# Altium project PowerBoard.PrjPcb
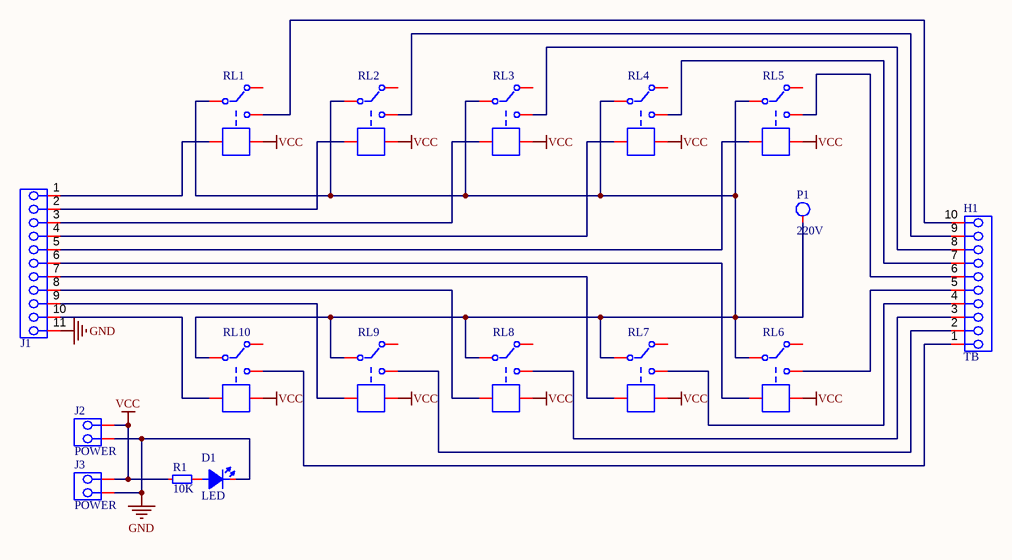
[diagram p0: PowerBoard.SchDoc]
1 sheet, 17 parts. Net scope: global (net labels, ports and power ports of the same name join across sheets).
Board file: PowerBoard.PcbDoc

## Sheet PowerBoard.SchDoc
size A; SheetNumber: 1; SheetTotal: 1

### Parts
D1  LED  [LED_5MM]
H1  TB  [TERMINAL-BLOCK-7.62MM -10PIN]
J1  HEADER-MALE-2.54MM  [HEADER-MALE-11PINS-2.54MM]  (value not drawn)
J2  POWER  [DG306-5.0-02P-12-00AH]
J3  POWER  [DG306-5.0-02P-12-00AH]
P1  220V  [SolderPoint]
R1  10K  [RES-0.25W-H]
RL1  Relay-SONGLE-SRD-05VDC  [RELAY-SONGLE-SRD-05VDC_BLUE]  (value not drawn)
RL2  Relay-SONGLE-SRD-05VDC  [RELAY-SONGLE-SRD-05VDC_BLUE]  (value not drawn)
RL3  Relay-SONGLE-SRD-05VDC  [RELAY-SONGLE-SRD-05VDC_BLUE]  (value not drawn)
RL4  Relay-SONGLE-SRD-05VDC  [RELAY-SONGLE-SRD-05VDC_BLUE]  (value not drawn)
RL5  Relay-SONGLE-SRD-05VDC  [RELAY-SONGLE-SRD-05VDC_BLUE]  (value not drawn)
RL6  Relay-SONGLE-SRD-05VDC  [RELAY-SONGLE-SRD-05VDC_BLUE]  (value not drawn)
RL7  Relay-SONGLE-SRD-05VDC  [RELAY-SONGLE-SRD-05VDC_BLUE]  (value not drawn)
RL8  Relay-SONGLE-SRD-05VDC  [RELAY-SONGLE-SRD-05VDC_BLUE]  (value not drawn)
RL9  Relay-SONGLE-SRD-05VDC  [RELAY-SONGLE-SRD-05VDC_BLUE]  (value not drawn)
RL10  Relay-SONGLE-SRD-05VDC  [RELAY-SONGLE-SRD-05VDC_BLUE]  (value not drawn)

### Nets
GND: D1.2(K) J1.11 J2.2 J3.2
VCC: J2.1 J3.1 R1.1 RL1.3 RL2.3 RL3.3 RL4.3 RL5.3 RL6.3 RL7.3 RL8.3 RL9.3 RL10.3
NetD1_1: D1.1(A) R1.2
NetH1_1: H1.1 RL10.4
NetH1_2: H1.2 RL9.4
NetH1_3: H1.3 RL8.4
NetH1_4: H1.4 RL7.4
NetH1_5: H1.5 RL6.4
NetH1_6: H1.6 RL5.4
NetH1_7: H1.7 RL4.4
NetH1_8: H1.8 RL3.4
NetH1_9: H1.9 RL2.4
NetH1_10: H1.10 RL1.4
NetJ1_1: J1.1 RL1.1
NetJ1_2: J1.2 RL2.1
NetJ1_3: J1.3 RL3.1
NetJ1_4: J1.4 RL4.1
NetJ1_5: J1.5 RL5.1
NetJ1_6: J1.6 RL6.1
NetJ1_7: J1.7 RL7.1
NetJ1_8: J1.8 RL8.1
NetJ1_9: J1.9 RL9.1
NetJ1_10: J1.10 RL10.1
NetP1_1: P1.1 RL1.2 RL2.2 RL3.2 RL4.2 RL5.2 RL6.2 RL7.2 RL8.2 RL9.2 RL10.2

Not connected (* = marked no-connect by the designer): RL1 5; RL2 5; RL3 5; RL4 5; RL5 5; RL6 5; RL7 5; RL8 5; RL9 5; RL10 5

### Library data of the parts
D1 = LED 5MM
H1 = TERMINAL-BLOCK-7.62MM-10PIN
J1 = HEADER-MALE-11PINS-2.54MM
J2 J3 = DG306-5.0-02P-12-00AH
P1 = SolderPoint
R1 = Resistors THD